# EAGLE design main (EAGLE 6.5.0)
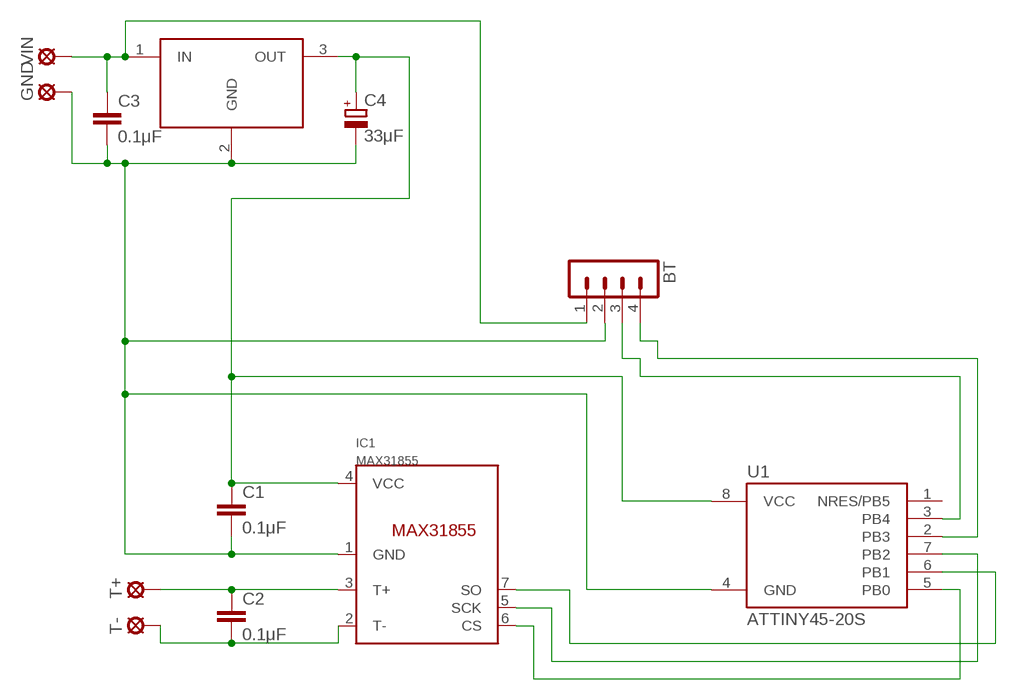
[diagram p0: schematic, sheet 1]

## Parts
BT  MA04-1  [MA04-1]
C1  0.1μF  C-EUC1206  [C1206]
C2  0.1μF  C-EUC1206  [C1206]
C3  0.1μF  C-EUC1206  [C1206]
C4  33μF  CPOL-EUE1.8-4  [E1,8-4]
GND  LSP13  [LSP13]
IC1  MAX31855  [SOIC8]
IC2  LM3940IMP-3.3  [SOT223]
T+  LSP13  [LSP13]
T-  LSP13  [LSP13]
U1  ATTINY45-20S  [SOIC8_EIAJ_208MIL]
VIN  LSP13  [LSP13]

## Nets
N$1: IC1.5(SCK) U1.7(PB2)
N$2: BT.2 C1.2 C3.2 C4.- GND.MP IC1.1(GND) IC2.2(GND) U1.4(GND)
N$3: C2.1 IC1.3(T+) T+.MP
N$4: C2.2 IC1.2(T-) T-.MP
N$5: IC1.6(CS) U1.5(PB0)
N$6: IC1.7(SO) U1.6(PB1)
N$7: C1.1 C4.+ IC1.4(VCC) IC2.3(OUT) U1.8(VCC)
N$8: BT.1 C3.1 IC2.1(IN) VIN.MP
N$9: BT.3 U1.3(PB4)
N$10: BT.4 U1.2(PB3)
Unconnected: U1.1(NRES/PB5)

## Library data of the parts
BT = con-lstb:MA04-1: PIN HEADER; OC_FARNELL: unknown; OC_NEWARK: unknown
C1-C3 = rcl:C-EU: CAPACITOR, European symbol
C4 = resistor:CPOL-EU: POLARIZED CAPACITOR, European symbol
GND T+ T- VIN = solpad:LSP13: SOLDER PAD drill 1.3 mm, distributor Buerklin, 12H562
IC1 = AlexW-Eagle-Libraries:MAX31855
IC2 = LM3940:LM3940IMP-3.3: 1A Low Dropout Regulator for 5V to 3.3V Conversion
U1 = _hhn_attiny25_45_85:ATTINY45*: ATMEL ATtiny 45 Packages: P = PDIP 08 30mil S = SOIC 08 EIAJ 208mil X = TSSOP 08 4.4mm Technologies Note: for complete ordering code (temp. range, finish, tape&reel etc.) see www.atmel.com • Supply Voltage: V = (1.8…5.5)V | [blank] = (2.7…5.5)V • Speed: 10 = 10 MHz | 20 = 20 MHz Author: Dipl.-Ing. FH Rainer Bayer HHN Hochschule Heilbronn (Heilbronn University), rainer.bayer@hs-heilbronn.de Ingenieurbüro ing-rb, mail@ing-rb.de

## Board
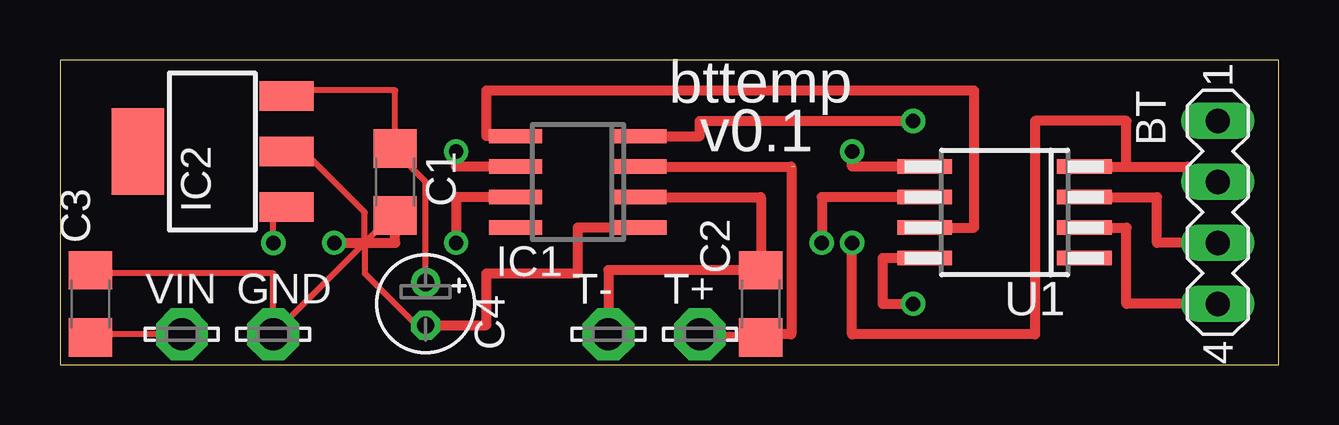
[diagram p1: board, top side]
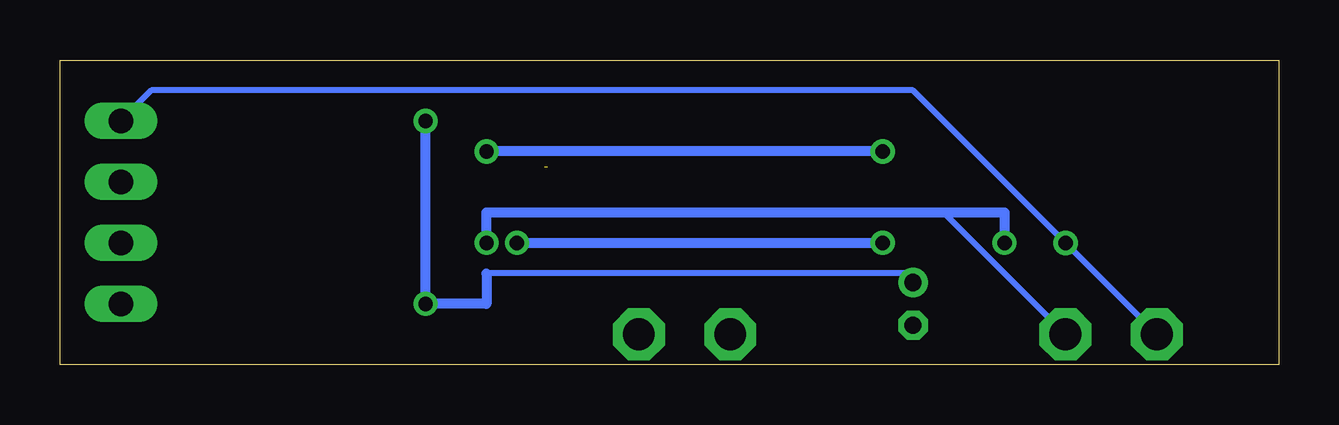
[diagram p2: board, bottom side, seen from below]

Size 50.8 x 12.7 mm. Coordinates in mm from the lower left corner, seen from the top.
Outline: 0,0 50.8,0 50.8,12.7 0,12.7 0,0
Copper layers (1*16): Top 0.035mm / dielectric 1.5mm / Bottom 0.035mm
Design rules "default": minimum track width 10mil, minimum drill 24mil, track to track 8mil, track to pad 8mil, pad to pad 8mil, via to via 8mil, smd to smd 8mil, copper to edge 40mil, drill to drill 8mil, minimum pad ring 10mil, minimum via ring 8mil, stop-mask expansion 4mil, vias tented up to drill 0mil, thermal gap 10mil

### Footprints (pad centres in the part's own frame; a part is rotated, then mirrored left to right if it is on the bottom)
MA04-1 = drill 1.016 long: 1 -3.81,0; 2 -1.27,0; 3 1.27,0; 4 3.81,0
C1206 = smd 1.6 x 1.8: 1 -1.4,0; 2 1.4,0
E1,8-4 = drill 0.711 pad 1.168: + -0.889,0 | drill 0.711 pad 1.168 octagon: - 0.889,0
LSP13 = drill 1.321 pad 2.159 octagon: MP 0,0
SOIC8 = smd 0.6 x 2.2: 1 -1.905,-2.6; 2 -0.635,-2.6; 3 0.635,-2.6; 4 1.905,-2.6; 5 1.905,2.6; 6 0.635,2.6; 7 -0.635,2.6; 8 -1.905,2.6
SOT223 = smd 1.219 x 2.235: 1 -2.311,-3.099; 2 0,-3.099; 3 2.311,-3.099 | smd 3.6 x 2.2: 4 0,3.099
SOIC8_EIAJ_208MIL = smd 0.6 x 2.286: 1 -1.905,-3.33; 2 -0.635,-3.33; 3 0.635,-3.33; 4 1.905,-3.33; 5 1.905,3.33; 6 0.635,3.33; 7 -0.635,3.33; 8 -1.905,3.33

### Placement (x,y rotation side)
BT  48.26,6.35 270 top
C1  13.97,7.62 270 top
C2  29.21,2.54 90 top
C3  1.27,2.54 90 top
C4  15.24,2.54 270 top
GND  8.89,1.27 0 top
IC1  21.59,7.62 90 top
IC2  6.35,8.89 90 top
T+  26.67,1.27 0 top
T-  22.86,1.27 0 top
U1  39.37,6.35 90 top
VIN  5.08,1.27 0 top

### Tracks (layer width: path | path; a pad name or v marks a point on that pad's centre or on a via)
N$1
  Top 0.406: IC1.5 17.78,9.53 17.78,11.43 38.1,11.43 38.1,5.71 U1.7
N$2  (via drill 0.6)
  Top 0.254: C3.2 1.27,3.81 8.89,3.81 GND.MP 12.7,5.08 | 12.7,5.08 13.97,6.35 C1.2 | 12.7,5.08 12.7,6.35 10.16,8.89 IC2.2 | 12.7,5.08 12.7,3.81 15.24,1.27 C4.-
  Top 0.406: C4.- 17.78,1.65 17.78,3.81 21.59,3.81 21.59,5.71 IC1.1 | BT.2 46.99,7.62 46.99,8.26 U1.4 44.45,8.26 44.45,10.16 40.64,10.16 40.64,1.27 33.02,1.27 v33.02,5.08 | v11.43,5.08 13.97,5.08 C1.2
  Bottom 0.254: GND.MP 13.97,6.35
  Bottom 0.406: v33.02,5.08 33.02,6.35 11.43,6.35 v11.43,5.08
N$3  (1 unrouted)
  Top 0.406: IC1.3 30.48,8.26 30.48,1.27 29.21,1.27 C2.1 26.67,1.14 T+.MP
N$4
  Top 0.406: IC1.2 29.21,6.99 C2.2 22.86,3.94 T-.MP
N$5  (via drill 0.6)
  Top 0.406: IC1.6 16.51,8.26 v16.51,8.89 | U1.5 33.02,8.26 v33.02,8.89
  Bottom 0.406: v16.51,8.89 v33.02,8.89
N$6  (via drill 0.6)
  Top 0.406: IC1.7 16.51,6.99 v16.51,5.08 | U1.6 31.75,6.99 v31.75,5.08
  Bottom 0.406: v31.75,5.08 v16.51,5.08
N$7  (via drill 0.6)
  Top 0.254: C4.+ 15.24,7.62 13.97,8.89 C1.1 13.97,11.43 10.16,11.43 IC2.3
  Top 0.406: IC1.4 26.67,9.53 26.67,10.16 v35.56,10.16 | U1.8 34.29,4.45 34.29,2.54 v35.56,2.54
  Bottom 0.254: 33.02,3.81 15.24,3.81 C4.+
  Bottom 0.406: 33.02,3.81 33.02,2.54 v35.56,2.54 v35.56,10.16
N$8  (via drill 0.61)
  Top 0.254: VIN.MP 1.27,1.27 C3.1 | v8.89,5.08 8.89,6.35 IC2.1
  Bottom 0.254: VIN.MP v8.89,5.08 15.24,11.43 46.99,11.43 BT.1
N$9
  Top 0.406: BT.3 45.72,5.08 45.72,6.99 U1.3
N$10
  Top 0.406: BT.4 44.45,2.54 44.45,5.71 U1.2

### Text on the board
tPlace: bttemp | v0.1